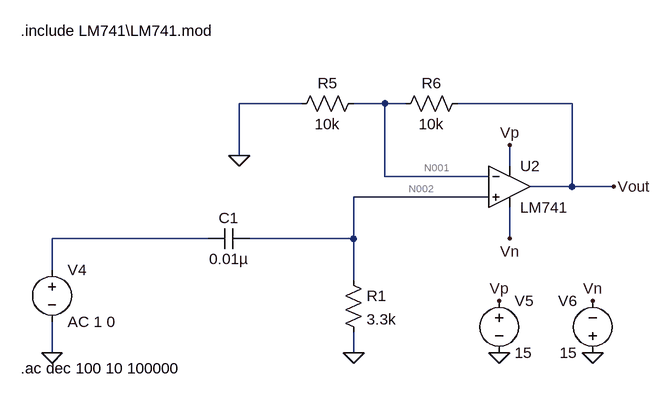
[diagram p0: schematic hpSK.asc]
hpSK.asc, the LTspice schematic file:
Version 4
SHEET 1 880 1064
WIRE 304 640 208 640
WIRE 432 640 384 640
WIRE 464 640 432 640
WIRE 720 640 544 640
WIRE 208 720 208 640
WIRE 624 736 624 704
WIRE 432 752 432 640
WIRE 592 752 432 752
WIRE 720 768 720 640
WIRE 720 768 656 768
WIRE 784 768 720 768
WIRE 592 784 384 784
WIRE 160 848 -80 848
WIRE 384 848 384 784
WIRE 384 848 224 848
WIRE 624 848 624 800
WIRE -80 896 -80 848
WIRE 384 912 384 848
WIRE -80 1024 -80 976
WIRE 384 1024 384 992
FLAG -80 1024 0
FLAG 208 720 0
FLAG 784 768 Vout
FLAG 624 704 Vp
FLAG 624 848 Vn
FLAG 608 944 Vp
FLAG 752 944 Vn
FLAG 608 1024 0
FLAG 752 1024 0
FLAG 384 1024 0
SYMBOL res 400 624 R90
WINDOW 0 0 56 VBottom 2
WINDOW 3 32 56 VTop 2
SYMATTR InstName R5
SYMATTR Value 10k
SYMBOL res 560 624 R90
WINDOW 0 0 56 VBottom 2
WINDOW 3 32 56 VTop 2
SYMATTR InstName R6
SYMATTR Value 10k
SYMBOL voltage -80 880 R0
WINDOW 123 0 0 Left 0
WINDOW 39 0 0 Left 0
SYMATTR InstName V4
SYMATTR Value AC 1 0
SYMBOL OpAmps\\opamp2 624 704 R0
SYMATTR InstName U2
SYMATTR Value LM741
SYMBOL voltage 608 928 R0
WINDOW 123 0 0 Left 0
WINDOW 39 0 0 Left 0
SYMATTR InstName V5
SYMATTR Value 15
SYMBOL voltage 752 1040 R180
WINDOW 0 24 96 Left 2
WINDOW 3 24 16 Left 2
WINDOW 123 0 0 Left 0
WINDOW 39 0 0 Left 0
SYMATTR InstName V6
SYMATTR Value 15
SYMBOL res 368 896 R0
SYMATTR InstName R1
SYMATTR Value 3.3k
SYMBOL cap 224 832 R90
WINDOW 0 0 32 VBottom 2
WINDOW 3 32 32 VTop 2
SYMATTR InstName C1
SYMATTR Value 0.01µ
TEXT -128 528 Left 2 !.include LM741\\LM741.mod
TEXT -128 1048 Left 2 !.ac dec 100 10 100000

The netlist it stands for:
* hpSK.asc
R5 N001 0 10k
R6 Vout N001 10k
V4 N003 0 AC 1 0
XU2 N002 N001 Vp Vn Vout LM741  ; pins In+ In- V+ V- OUT
V5 Vp 0 15
V6 0 Vn 15
R1 N002 0 3.3k
C1 N002 N003 0.01µ
.include LM741\LM741.mod
.ac dec 100 10 100000
.backanno
.end

* Results of the author's LTspice run, read from the files saved beside the schematic
* Operating Point, zero values left out:
*   V(n001) = 809.1 µV
*   V(vout) = 2.637 mV
*   V(n002) = -190.9 µV
*   V(vn) = -15 V
*   V(vp) = 15 V
*   I(R1) = -57.86 nA
*   I(R6) = 182.8 nA
*   I(R5) = 80.91 nA
*   I(V6) = -1.701 mA
*   I(V5) = -1.701 mA
*   Ix(u2:1) = 57.86 nA
*   Ix(u2:2) = 101.9 nA
*   Ix(u2:99) = 1.701 mA
*   Ix(u2:50) = -1.701 mA
*   Ix(u2:28) = -182.8 nA
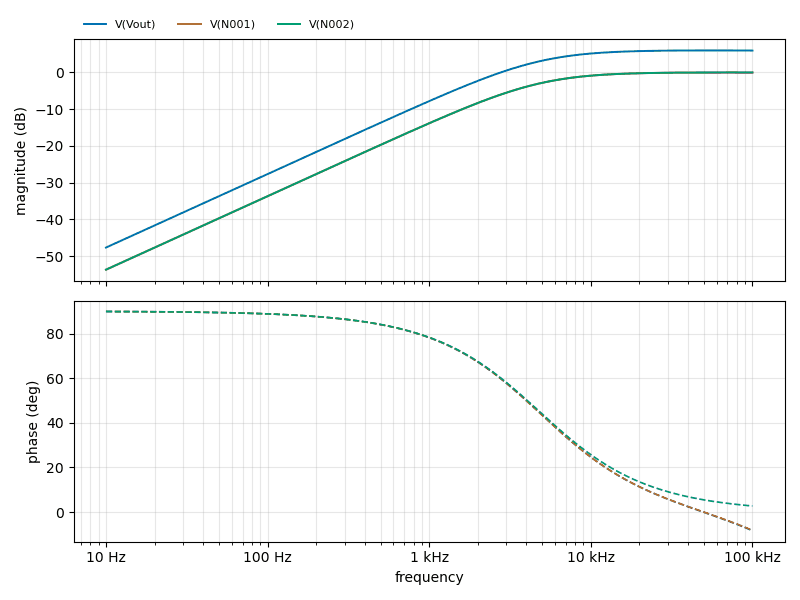
[diagram p1: AC Analysis of hpSK.asc, plotted from the saved traces]
* AC Analysis, 1 run:
*   V(Vout): -47.65 dB at 10 Hz, 5.91 dB at 100 kHz, peak 5.96 dB at 56.23 kHz, 3 dB below the peak at 4.754 kHz
*   V(N001): -53.67 dB at 10 Hz, -0.11 dB at 100 kHz, peak -0.06 dB at 56.23 kHz, 3 dB below the peak at 4.754 kHz
*   V(N002): -53.67 dB at 10 Hz, -0.01 dB at 100 kHz, peak -0.01 dB at 100 kHz, 3 dB below the peak at 4.811 kHz